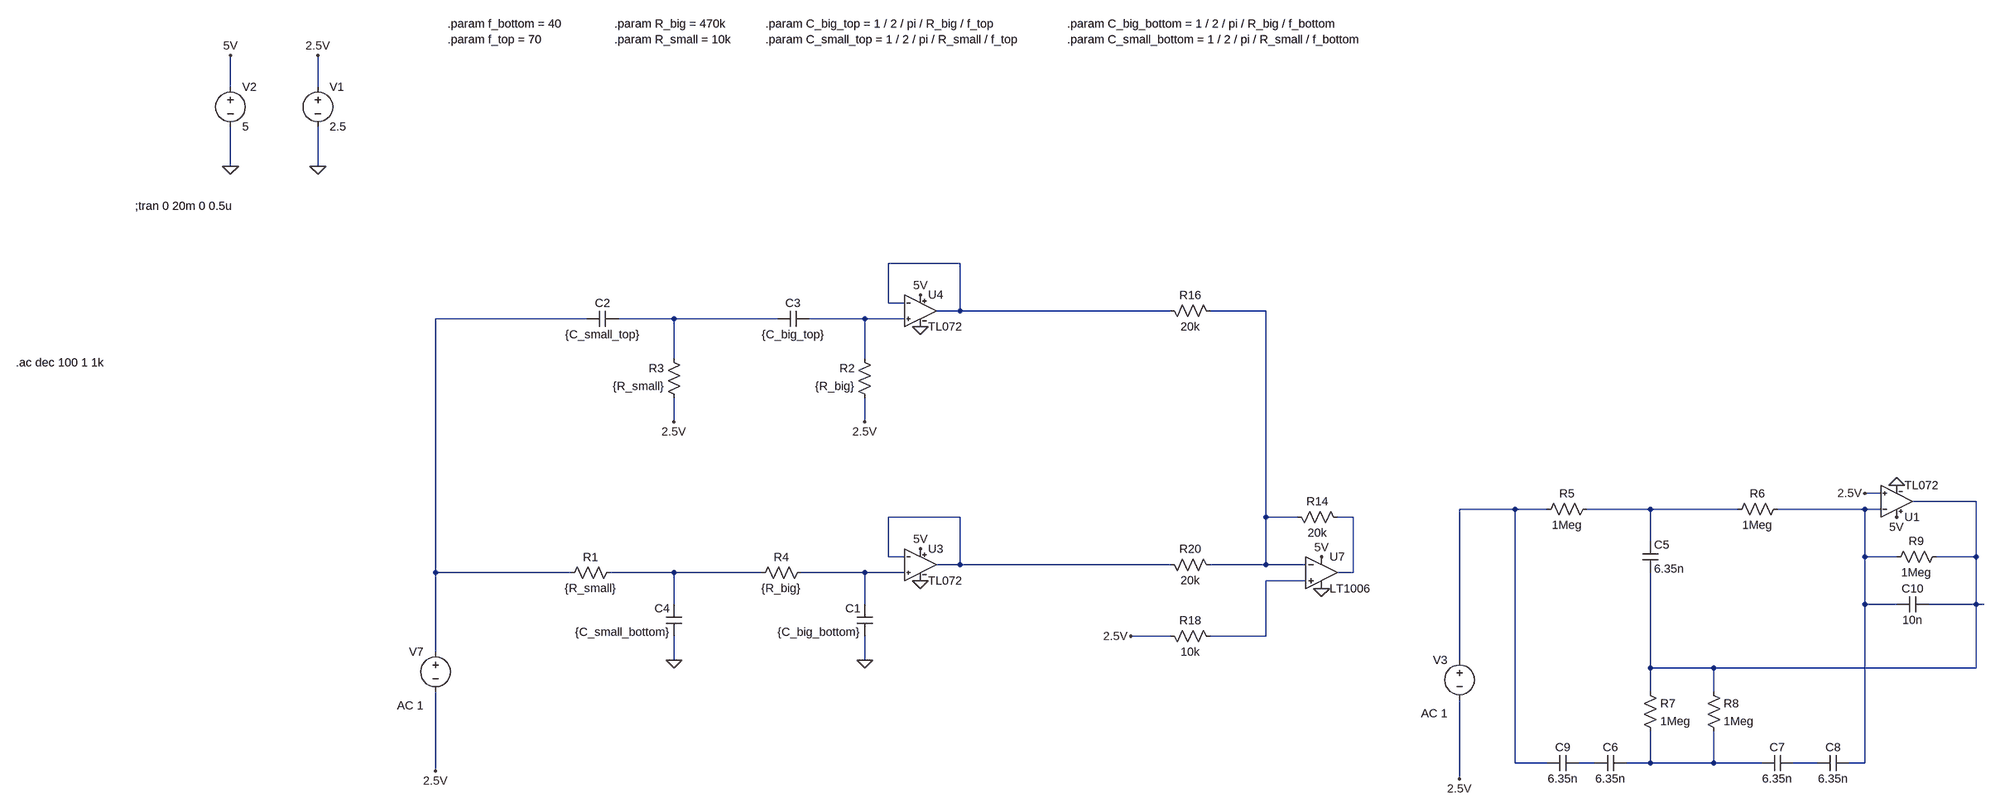
[diagram p0: schematic mains_bandstop_novi.asc]
mains_bandstop_novi.asc, the LTspice schematic file:
Version 4
SHEET 1 2972 1716
WIRE -1456 -272 -1456 -336
WIRE -1280 -272 -1280 -336
WIRE -1456 -112 -1456 -192
WIRE -1280 -112 -1280 -192
WIRE 48 160 -96 160
WIRE -96 240 -96 160
WIRE -64 240 -96 240
WIRE 48 256 48 160
WIRE 48 256 0 256
WIRE 480 256 48 256
WIRE 672 256 560 256
WIRE -704 272 -1008 272
WIRE -528 272 -640 272
WIRE -320 272 -528 272
WIRE -144 272 -256 272
WIRE -64 272 -144 272
WIRE -528 352 -528 272
WIRE -144 352 -144 272
WIRE -528 480 -528 432
WIRE -144 480 -144 432
WIRE 2000 624 1968 624
WIRE 2192 640 2064 640
WIRE 1264 656 1152 656
WIRE 1328 656 1264 656
WIRE 1536 656 1408 656
WIRE 1712 656 1536 656
WIRE 1968 656 1792 656
WIRE 2000 656 1968 656
WIRE 48 672 -96 672
WIRE 672 672 672 256
WIRE 736 672 672 672
WIRE 848 672 816 672
WIRE 1536 720 1536 656
WIRE -96 752 -96 672
WIRE -64 752 -96 752
WIRE 1968 752 1968 656
WIRE 2032 752 1968 752
WIRE 2192 752 2192 640
WIRE 2192 752 2112 752
WIRE 48 768 48 672
WIRE 48 768 0 768
WIRE 480 768 48 768
WIRE 672 768 672 672
WIRE 672 768 560 768
WIRE 752 768 672 768
WIRE -1008 784 -1008 272
WIRE -736 784 -1008 784
WIRE -528 784 -656 784
WIRE -352 784 -528 784
WIRE -144 784 -272 784
WIRE -64 784 -144 784
WIRE 848 784 848 672
WIRE 848 784 816 784
WIRE 752 800 672 800
WIRE -528 848 -528 784
WIRE -144 848 -144 784
WIRE 1968 848 1968 752
WIRE 2032 848 1968 848
WIRE 2192 848 2192 752
WIRE 2192 848 2096 848
WIRE 2208 848 2192 848
WIRE 480 912 400 912
WIRE 672 912 672 800
WIRE 672 912 560 912
WIRE -1008 944 -1008 784
WIRE -528 960 -528 912
WIRE -144 960 -144 912
WIRE 1152 960 1152 656
WIRE 1536 976 1536 784
WIRE 1664 976 1536 976
WIRE 2192 976 2192 848
WIRE 2192 976 1664 976
WIRE 1536 1024 1536 976
WIRE 1664 1024 1664 976
WIRE 1264 1168 1264 656
WIRE 1328 1168 1264 1168
WIRE 1424 1168 1392 1168
WIRE 1536 1168 1536 1104
WIRE 1536 1168 1488 1168
WIRE 1664 1168 1664 1104
WIRE 1664 1168 1536 1168
WIRE 1760 1168 1664 1168
WIRE 1872 1168 1824 1168
WIRE 1968 1168 1968 848
WIRE 1968 1168 1936 1168
WIRE -1008 1184 -1008 1024
WIRE 1152 1200 1152 1040
FLAG -1456 -112 0
FLAG -1456 -336 5V
FLAG 784 816 0
FLAG 784 752 5V
FLAG 400 912 2.5V
FLAG -1280 -112 0
FLAG -1280 -336 2.5V
FLAG -32 800 0
FLAG -32 736 5V
FLAG -144 960 0
FLAG -32 288 0
FLAG -32 224 5V
FLAG -1008 1184 2.5V
FLAG -144 480 2.5V
FLAG -528 480 2.5V
FLAG -528 960 0
FLAG 2032 608 0
FLAG 2032 672 5V
FLAG 1152 1200 2.5V
FLAG 1968 624 2.5V
SYMBOL voltage -1456 -288 R0
WINDOW 123 0 0 Left 0
WINDOW 39 0 0 Left 0
SYMATTR InstName V2
SYMATTR Value 5
SYMBOL voltage -1008 928 M0
WINDOW 123 24 124 Left 2
WINDOW 39 0 0 Left 0
SYMATTR Value2 AC 1
SYMATTR InstName V7
SYMATTR Value ""
SYMBOL res 720 656 M90
WINDOW 0 0 56 VBottom 2
WINDOW 3 32 56 VTop 2
SYMATTR InstName R14
SYMATTR Value 20k
SYMBOL OpAmps\\LT1006 784 720 R0
SYMATTR InstName U7
SYMBOL res 464 896 M90
WINDOW 0 0 56 VBottom 2
WINDOW 3 32 56 VTop 2
SYMATTR InstName R18
SYMATTR Value 10k
SYMBOL res 464 240 M90
WINDOW 0 0 56 VBottom 2
WINDOW 3 32 56 VTop 2
SYMATTR InstName R16
SYMATTR Value 20k
SYMBOL res 464 752 M90
WINDOW 0 0 56 VBottom 2
WINDOW 3 32 56 VTop 2
SYMATTR InstName R20
SYMATTR Value 20k
SYMBOL voltage -1280 -288 R0
WINDOW 123 0 0 Left 0
WINDOW 39 0 0 Left 0
SYMATTR InstName V1
SYMATTR Value 2.5
SYMBOL cap -640 256 R90
WINDOW 0 0 32 VBottom 2
WINDOW 3 32 32 VTop 2
SYMATTR InstName C2
SYMATTR Value {C_small_top}
SYMBOL res -128 448 R180
WINDOW 0 36 76 Left 2
WINDOW 3 36 40 Left 2
SYMATTR InstName R2
SYMATTR Value {R_big}
SYMBOL cap -256 256 R90
WINDOW 0 0 32 VBottom 2
WINDOW 3 32 32 VTop 2
SYMATTR InstName C3
SYMATTR Value {C_big_top}
SYMBOL res -512 448 R180
WINDOW 0 36 76 Left 2
WINDOW 3 36 40 Left 2
SYMATTR InstName R3
SYMATTR Value {R_small}
SYMBOL ZZZ\\OpAmp\\TL072 -32 768 R0
SYMATTR InstName U3
SYMBOL ZZZ\\OpAmp\\TL072 -32 256 R0
SYMATTR InstName U4
SYMBOL res -752 800 R270
WINDOW 0 32 56 VTop 2
WINDOW 3 0 56 VBottom 2
SYMATTR InstName R1
SYMATTR Value {R_small}
SYMBOL res -368 800 R270
WINDOW 0 32 56 VTop 2
WINDOW 3 0 56 VBottom 2
SYMATTR InstName R4
SYMATTR Value {R_big}
SYMBOL cap -512 912 R180
WINDOW 0 24 56 Left 2
WINDOW 3 24 8 Left 2
SYMATTR InstName C4
SYMATTR Value {C_small_bottom}
SYMBOL cap -128 912 R180
WINDOW 0 24 56 Left 2
WINDOW 3 24 8 Left 2
SYMATTR InstName C1
SYMATTR Value {C_big_bottom}
SYMBOL ZZZ\\OpAmp\\TL072 2032 640 M180
SYMATTR InstName U1
SYMBOL res 1312 672 R270
WINDOW 0 32 56 VTop 2
WINDOW 3 0 56 VBottom 2
SYMATTR InstName R5
SYMATTR Value 1Meg
SYMBOL voltage 1152 944 M0
WINDOW 123 24 124 Left 2
WINDOW 39 0 0 Left 0
SYMATTR Value2 AC 1
SYMATTR InstName V3
SYMATTR Value ""
SYMBOL res 1696 672 R270
WINDOW 0 32 56 VTop 2
WINDOW 3 0 56 VBottom 2
SYMATTR InstName R6
SYMATTR Value 1Meg
SYMBOL res 1520 1008 R0
SYMATTR InstName R7
SYMATTR Value 1Meg
SYMBOL res 1648 1008 R0
SYMATTR InstName R8
SYMATTR Value 1Meg
SYMBOL cap 1328 1184 R270
WINDOW 0 32 32 VTop 2
WINDOW 3 0 32 VBottom 2
SYMATTR InstName C9
SYMATTR Value 6.35n
SYMBOL res 2016 768 R270
WINDOW 0 32 56 VTop 2
WINDOW 3 0 56 VBottom 2
SYMATTR InstName R9
SYMATTR Value 1Meg
SYMBOL cap 1424 1184 R270
WINDOW 0 32 32 VTop 2
WINDOW 3 0 32 VBottom 2
SYMATTR InstName C6
SYMATTR Value 6.35n
SYMBOL cap 1760 1184 R270
WINDOW 0 32 32 VTop 2
WINDOW 3 0 32 VBottom 2
SYMATTR InstName C7
SYMATTR Value 6.35n
SYMBOL cap 1872 1184 R270
WINDOW 0 32 32 VTop 2
WINDOW 3 0 32 VBottom 2
SYMATTR InstName C8
SYMATTR Value 6.35n
SYMBOL cap 1520 720 R0
SYMATTR InstName C5
SYMATTR Value 6.35n
SYMBOL cap 2096 832 R90
WINDOW 0 0 32 VBottom 2
WINDOW 3 32 32 VTop 2
SYMATTR InstName C10
SYMATTR Value 10n
TEXT -1648 -32 Left 2 !;tran 0 20m 0 0.5u
TEXT -1888 360 Left 2 !.ac dec 100 1 1k
TEXT -984 -400 Left 2 !.param f_bottom = 40
TEXT -984 -368 Left 2 !.param f_top = 70
TEXT -648 -400 Left 2 !.param R_big = 470k
TEXT -648 -368 Left 2 !.param R_small = 10k
TEXT -344 -400 Left 2 !.param C_big_top = 1 / 2 / pi / R_big / f_top
TEXT -344 -368 Left 2 !.param C_small_top = 1 / 2 / pi / R_small / f_top
TEXT 272 -400 Left 2 !.param C_big_bottom = 1 / 2 / pi / R_big / f_bottom
TEXT 272 -368 Left 2 !.param C_small_bottom = 1 / 2 / pi / R_small / f_bottom

The netlist it stands for:
* mains_bandstop_novi.asc
V2 5V 0 5
V7 N003 2.5V AC 1
R14 N002 N011 20k
XU7 N014 N002 5V 0 N011 LT1006  ; pins In+ In- V+ V- OUT
R18 2.5V N014 10k
R16 N001 N002 20k
R20 N010 N002 20k
V1 2.5V 0 2.5
C2 N004 N003 {C_small_top}
R2 2.5V N005 {R_big}
C3 N005 N004 {C_big_top}
R3 2.5V N004 {R_small}
XU3 N013 N010 5V 0 N010 TL072  ; pins 1 2 3 4 5
XU4 N005 N001 5V 0 N001 TL072  ; pins 1 2 3 4 5
R1 N003 N012 {R_small}
R4 N012 N013 {R_big}
C4 0 N012 {C_small_bottom}
C1 0 N013 {C_big_bottom}
XU1 2.5V N009 5V 0 N006 TL072  ; pins 1 2 3 4 5
R5 N007 N008 1Meg
V3 N007 2.5V AC 1
R6 N008 N009 1Meg
R7 N006 N016 1Meg
R8 N006 N016 1Meg
C9 N007 N015 6.35n
R9 N009 N006 1Meg
C6 N015 N016 6.35n
C7 N016 N017 6.35n
C8 N017 N009 6.35n
C5 N008 N006 6.35n
C10 N006 N009 10n
;tran 0 20m 0 0.5u
.ac dec 100 1 1k
.param f_bottom = 40
.param f_top = 70
.param R_big = 470k
.param R_small = 10k
.param C_big_top = 1 / 2 / pi / R_big / f_top
.param C_small_top = 1 / 2 / pi / R_small / f_top
.param C_big_bottom = 1 / 2 / pi / R_big / f_bottom
.param C_small_bottom = 1 / 2 / pi / R_small / f_bottom
.lib LTC.lib
.lib TL072.cir
.backanno
.end